# EAGLE design ledtiny85 (EAGLE 8.1.0)
DESIGNER: Willie Zhu
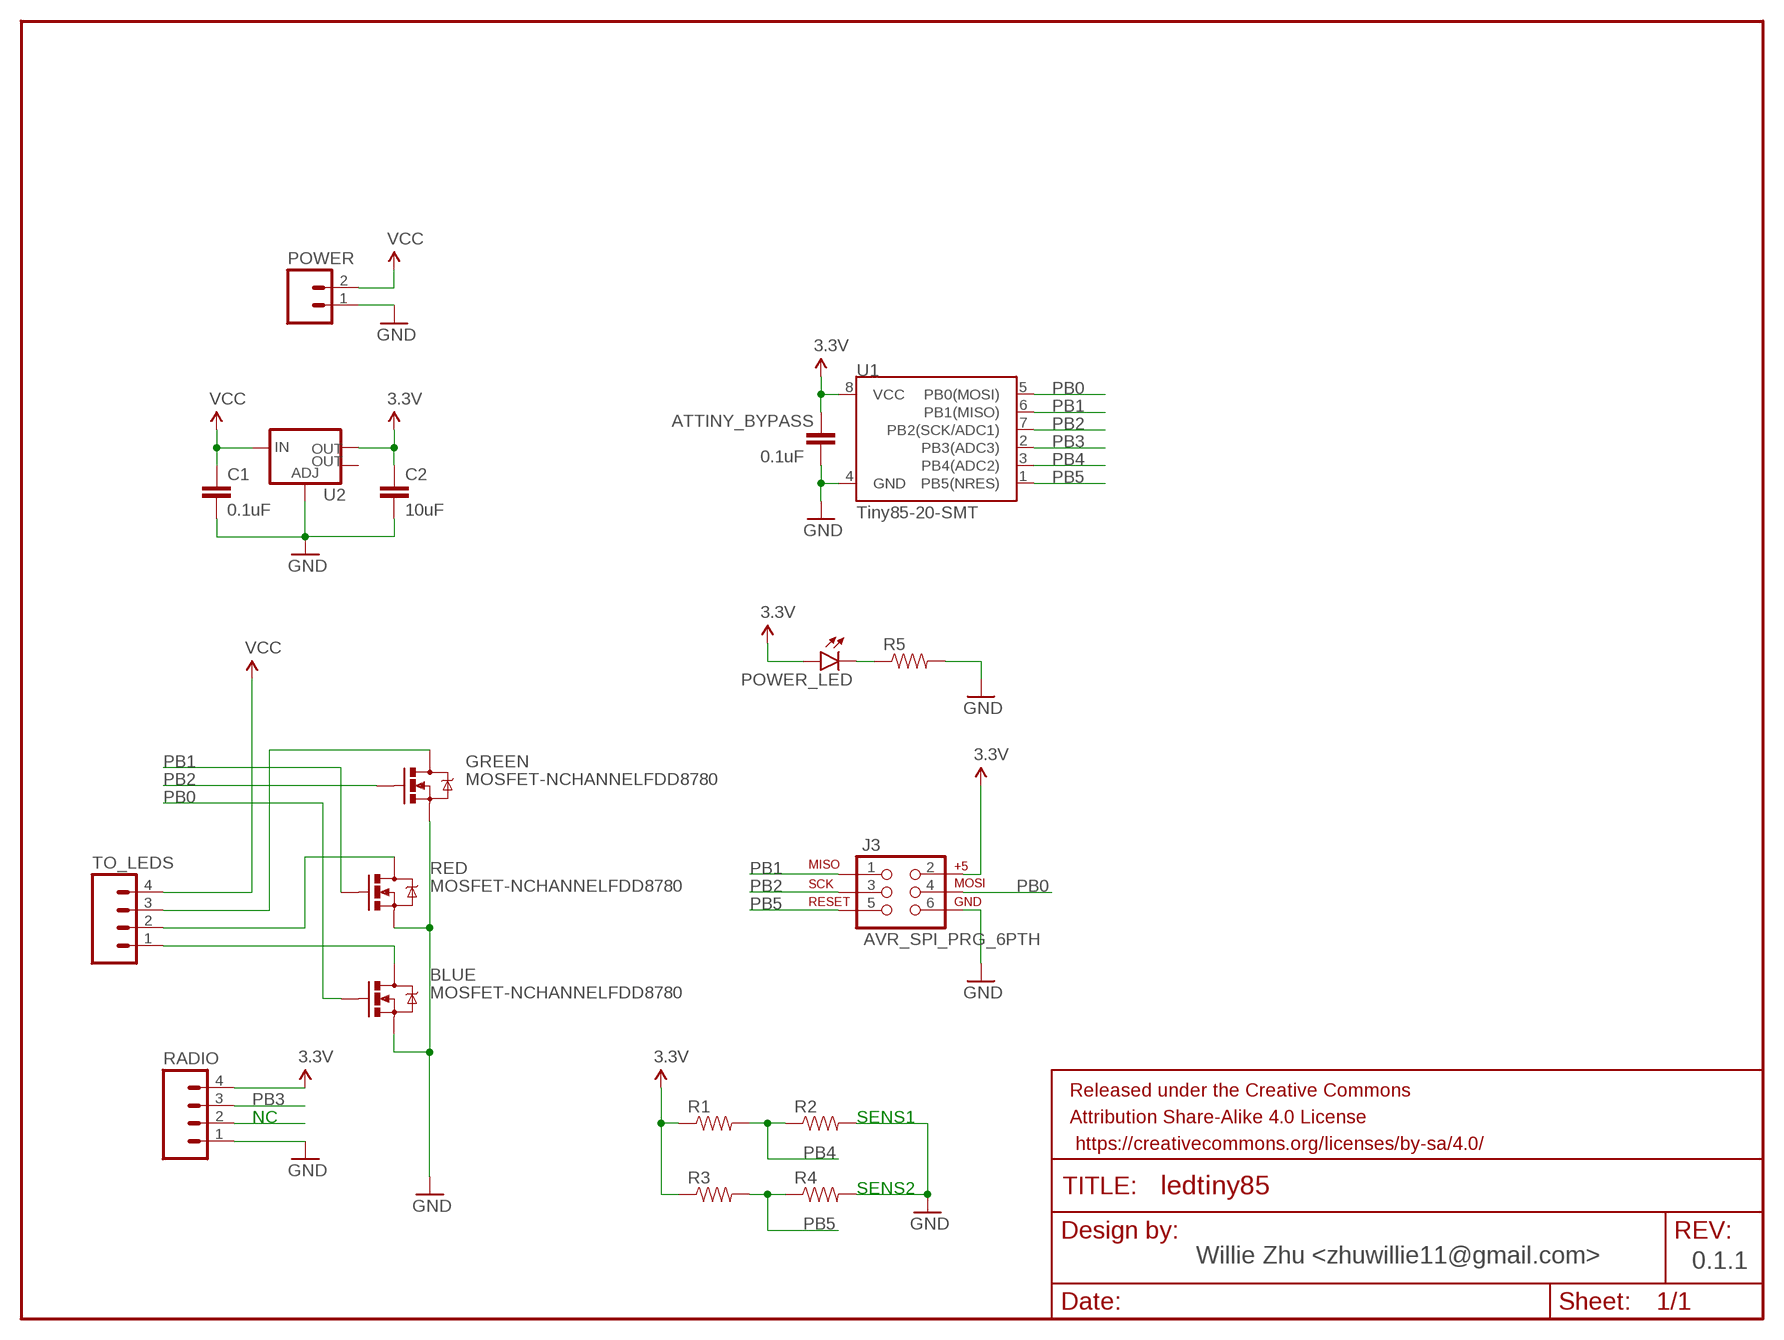
[diagram p0: schematic, sheet 1]

## Parts
ATTINY_BYPASS  0.1uF  CAP1206  [1206]
BLUE  MOSFET-NCHANNELFDD8780  [DPAK]
C1  0.1uF  CAP1206  [1206]
C2  10uF  CAP1206  [1206]
FRAME1  FRAME-LETTER  [CREATIVE_COMMONS]
GREEN  MOSFET-NCHANNELFDD8780  [DPAK]
J3  AVR_SPI_PRG_6PTH  [2X3]
POWER  M02PTH3  [1X02_LONGPADS]
POWER_LED  LED1206  [LED-1206]
R1  RESISTOR1206  [1206]
R2  RESISTOR1206  [1206]
R3  RESISTOR1206  [1206]
R4  RESISTOR1206  [1206]
R5  RESISTOR1206  [1206]
RADIO  M04LONGPADS  [1X04_LONGPADS]
RED  MOSFET-NCHANNELFDD8780  [DPAK]
TO_LEDS  M04LONGPADS  [1X04_LONGPADS]
U1  Tiny85-20-SMT  ATTINY45TINY85-20-SMT  [SO08-EIAJ]
U2  V_REG_LM1117SOT223  [SOT223]

## Nets
3.3V: ATTINY_BYPASS.1 C2.1 J3.2 POWER_LED.A R1.1 R3.1 RADIO.4 U1.8(VCC) U2.2(OUT)
BLUE: BLUE.4(D) TO_LEDS.1
GND: ATTINY_BYPASS.2 BLUE.3(S) C1.2 C2.2 GREEN.3(S) J3.6 POWER.1 R2.2 R4.2 R5.2 RADIO.1 RED.3(S) U1.4(GND) U2.1(ADJ)
GREEN: RED.4(D) TO_LEDS.2
N$1: POWER_LED.C R5.1
N$6: RADIO.2
PB0: BLUE.1(G) J3.4 U1.5(PB0(MOSI))
PB1: J3.1 RED.1(G) U1.6(PB1(MISO))
PB2: GREEN.1(G) J3.3 U1.7(PB2(SCK/ADC1))
PB3: RADIO.3 U1.2(PB3(ADC3))
PB4: R1.2 R2.1 U1.3(PB4(ADC2))
PB5: J3.5 R3.2 R4.1 U1.1(PB5(NRES))
RED: GREEN.4(D) TO_LEDS.3
VCC: C1.1 POWER.2 TO_LEDS.4 U2.3(IN)
Unconnected: U2.4(OUT)

## Notes on the sheet
- NC | SENS1
- SENS2
- Willie Zhu <zhuwillie11@gmail.com> | 0.1.1

## Library data of the parts
ATTINY_BYPASS C1 C2 = SparkFun-Passives:CAP: Capacitor Standard 0603 ceramic capacitor, and 0.1" leaded capacitor.
BLUE GREEN RED = SparkFun-DiscreteSemi:MOSFET-NCHANNEL: Common NMOSFET Parts MFG P/N Store ID Prod ID FDD8780 TRANS-09984 SI7820DN TRANS-11055 FDS6630A IC-08089 2N7002PW TRANS-11151 FQP30N06L COM-10213 TRANS-10060 BSS123LT1G TRANS-08345 BSS138 TRANS-00830 BS170 2N7000; PROD_ID: TRANS-09984
FRAME1 = SparkFun-Aesthetics:FRAME-LETTER: Schematic Frame Standard 8.5x11 US Letter frame
J3 = SparkFun-Connectors:AVR_SPI_PRG_6: AVR ISP 6 Pin This is the reduced ISP connector for AVR programming. Common on Arduino. This footprint will take up less PCB space and can be used with a 10-pin to 6-pin adapter such as SKU: BOB-08508 **Special note about "TEST_POINT" package. The stop mask is on the top side, so if you want your programming test points to be on the bottom of your board, make sure to place this package on the bottom side of the board. This also ensure that the orientation to program from the bottom side will be correct.
POWER = SparkFun-Connectors:M02: Standard 2-pin 0.1" header. Use with - straight break away headers ( PRT-00116) - right angle break away headers (PRT-00553) - swiss pins (PRT-00743) - machine pins (PRT-00117) - female headers (PRT-00115) Molex polarized connector foot print use with: PRT-08233 with associated crimp pins and housings. 2.54_SCREWTERM for use with PRT-10571. 3.5mm Screw Terminal footprints for PRT-08084 5mm Screw Terminal footprints for use with PRT-08432
POWER_LED = SparkFun-LED:LED: LEDs Standard schematic elements and footprints for 5mm, 3mm, 1206, and 0603 sized LEDs. 5mm - Spark Fun Electronics SKU : COM-00529 (and others)
R1-R5 = SparkFun-Passives:RESISTOR: Resistor Basic schematic elements and footprints for 0603, 1206, and PTH resistors.
RADIO TO_LEDS = SparkFun-Connectors:M04: Header 4 Standard 4-pin 0.1" header. Use with straight break away headers (SKU : PRT-00116), right angle break away headers (PRT-00553), swiss pins (PRT-00743), machine pins (PRT-00117), and female headers (PRT-00115). Molex polarized connector foot print use with SKU : PRT-08231 with associated crimp pins and housings. 1MM SMD Version SKU: PRT-10208; PROD_ID: CONN-09696
U1 = SparkFun-DigitalIC:ATTINY45: Atmel 8-pin 2/4/8kB flash uC; PROD_ID: IC-09092
U2 = SparkFun-PowerIC:V_REG_LM1117: Voltage Regulator LM1117 Standard adjustable voltage regulator but in SMD form. Spark Fun Electronics SKU : COM-00595; PROD_ID: VREG-08170

## Board
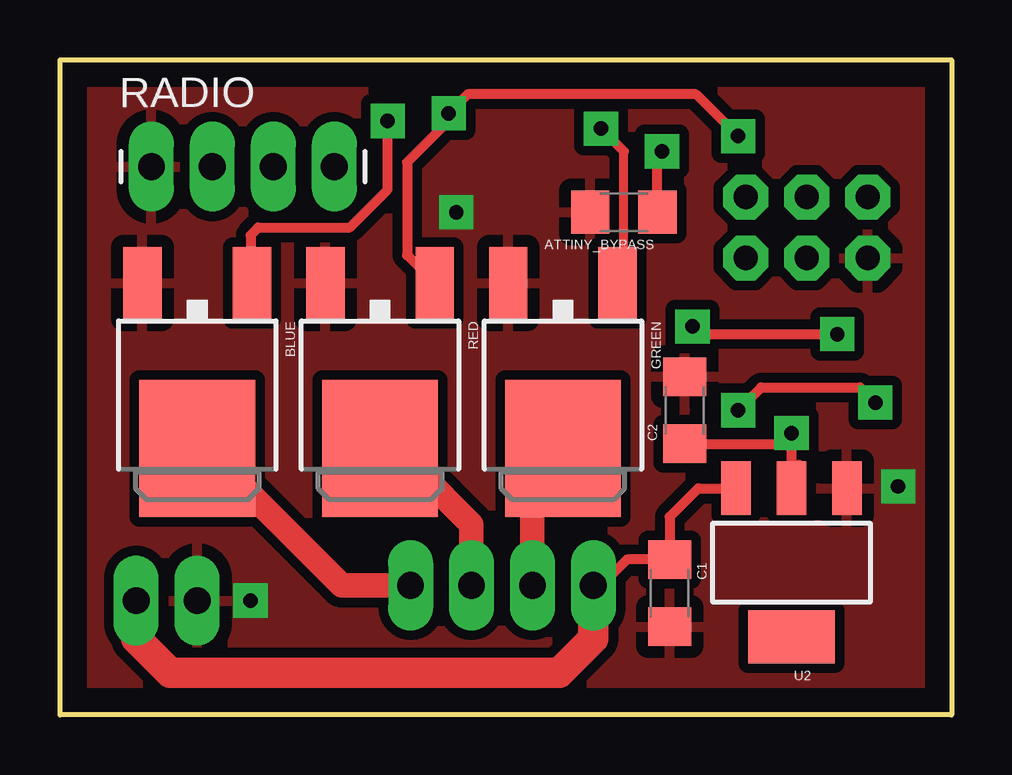
[diagram p1: board, top side]
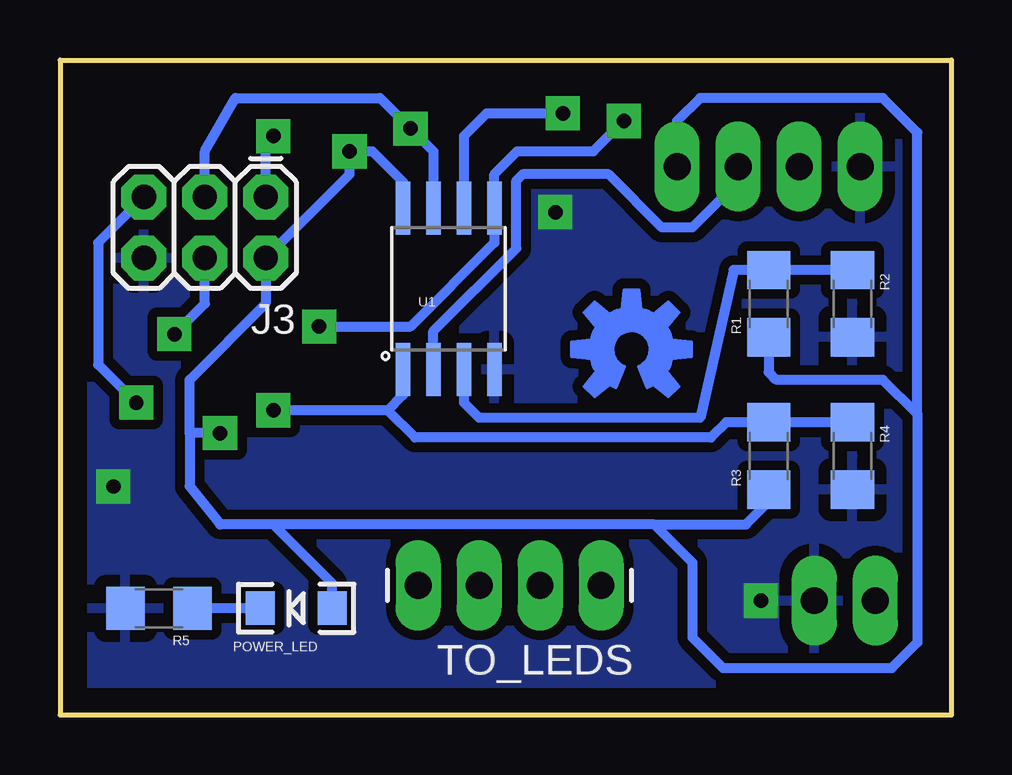
[diagram p2: board, bottom side, seen from below]

Size 37.15 x 27.3 mm. Coordinates in mm from the lower left corner, seen from the top.
Outline: 37.15,0 0,0 0,27.3 37.15,27.3 37.15,0
Copper layers (1*16): Top 0.035mm / dielectric 1.5mm / Bottom 0.035mm
Design rules "default *": minimum track width 10mil, minimum drill 16mil, track to track 16mil, track to pad 16mil, pad to pad 16mil, via to via 16mil, smd to smd 8mil, copper to edge 40mil, drill to drill 8mil, minimum pad ring 10mil, minimum via ring 8mil, stop-mask expansion 4mil, vias tented up to drill 0mil, thermal gap 20mil

### Footprints (pad centres in the part's own frame; a part is rotated, then mirrored left to right if it is on the bottom)
1206 = smd 1.6 x 1.8: 1 -1.4,0; 2 1.4,0
DPAK = smd 1.6 x 3: 1 -2.28,-5.31; 3 2.28,-5.31 | smd 4.826 x 5.715: 4 0,1.588
2X3 = drill 1.016 pad 1.88 octagon: 1 0,0; 2 0,2.54; 3 2.54,0; 4 2.54,2.54; 5 5.08,0; 6 5.08,2.54
1X02_LONGPADS = drill 1.118 pad 1.88 long: 1 0,0; 2 2.54,0
LED-1206 = smd 1.2 x 1.4: A -1.5,0; C 1.5,0
1X04_LONGPADS = drill 1.118 pad 1.88 long: 1 0,0; 2 2.54,0; 3 5.08,0; 4 7.62,0
SO08-EIAJ = smd 0.61 x 2.21: 1 -1.905,-3.378; 2 -0.635,-3.378; 3 0.635,-3.378; 4 1.905,-3.378; 5 1.905,3.353; 6 0.635,3.353; 7 -0.635,3.353; 8 -1.905,3.353
SOT223 = smd 1.219 x 2.235: 1 -2.311,-3.099; 2 0,-3.099; 3 2.311,-3.099 | smd 3.6 x 2.2: 4 0,3.099

### Placement (x,y rotation side)
ATTINY_BYPASS  23.5,20.96 180 top
BLUE  5.71,12.7 180 top
C1  25.4,5.08 270 top
C2  26.04,12.7 90 top
FRAME1  14.92,-13.02 0 top  (outside the outline)
GREEN  20.96,12.7 180 top
J3  28.57,21.59 180 bottom
POWER  5.71,4.76 0 bottom
POWER_LED  27.3,4.45 180 bottom
R1  7.62,17.14 90 bottom
R2  4.13,17.14 270 bottom
R3  7.62,10.79 90 bottom
R4  4.13,10.79 270 bottom
R5  33.02,4.45 180 bottom
RADIO  3.81,22.86 0 top
RED  13.33,12.7 180 top
TO_LEDS  14.6,5.4 180 bottom
U1  20.96,17.78 0 bottom
U2  30.48,6.35 180 top
U$2  [OSHW-LOGO-M_COPPER]  13.33,15.24 0 bottom

### Tracks (layer width: path | path; a pad name or v marks a point on that pad's centre or on a via)
3.3V  (via drill 0.6 pad 1.42)
  Top 0.406: 24.76,21.08 ATTINY_BYPASS.1 24.89,23.31 v25.08,23.49 | 30.8,10.43 30.8,9.77 U2.2 v30.48,11.75 30.35,11.3 C2.1
  Bottom 0.406: 31.75,11.75 31.75,9.52 30.48,7.94 28.26,7.94 | 31.75,11.75 31.75,13.97 28.57,17.14 J3.2 25.08,22.54 v25.08,23.49 24.13,23.49 22.86,22.23 U1.8 | 1.42,12.53 1.42,24.28 2.86,25.72 10.48,25.72 11.43,24.76 RADIO.4 | 1.42,12.53 1.42,3.02 2.49,1.96 9.52,1.96 10.8,3.23 10.8,6.35 12.38,7.94 | 7.62,15.24 R1.1 7.62,14.29 7.3,13.97 2.86,13.97 1.42,12.53 | 12.38,7.94 28.26,7.94 | 12.38,7.94 8.57,7.94 7.62,8.89 R3.1 | POWER_LED.A 25.8,5.49 28.26,7.94 | v30.48,11.75 31.75,11.75
BLUE
  Top 1.016: BLUE.4 6.03,11.11 11.75,5.4 TO_LEDS.1
GND  (via drill 0.6 pad 1.42)
  other vias: 34.92,9.52 7.94,4.76 16.51,20.96
  pour Top (isolate 0.406): 41.27,40.64 41.27,-1.27 -0.64,-1.27 -0.64,40.64
  pour Bottom (isolate 0.406): -1.9,41.91 42.54,41.91 42.54,-2.54 -1.9,-2.54
GREEN
  Top 1.016: 17.14,5.71 TO_LEDS.2 17.14,7.94 14.92,10.16 14.29,10.16 RED.4
N$1
  Bottom 0.406: POWER_LED.C R5.1
PB0  (via drill 0.6 pad 1.42)
  Top 0.406: BLUE.1 7.94,18.07 7.94,20 8.25,20.32 12.07,20.32 13.65,21.91 v13.65,24.76 | v26.35,16.19 26.67,15.87 v32.39,15.87
  Bottom 0.406: v32.39,15.87 31.12,17.14 J3.4 | v13.65,24.76 14.92,23.49 18.1,23.49 19.05,22.54 U1.5 19.05,19.69 22.54,16.19 v26.35,16.19
PB1  (via drill 0.6 pad 1.42)
  Top 0.406: RED.1 14.47,19.16 14.47,23.04 16.19,24.76 v16.19,25.08 16.99,25.88 26.51,25.88 v28.26,24.13
  Bottom 0.406: U1.6 20.32,24.13 19.37,25.08 v16.19,25.08 | J3.1 28.57,23.81 v28.26,24.13
PB2  (via drill 0.6 pad 1.42)
  Top 0.381: 23.49,18.27 23.49,23.49
  Top 0.406: GREEN.1 23.49,18.27 | 23.49,23.49 v22.54,24.45
  Bottom 0.406: U1.7 21.59,23.49 v22.54,24.45 23.81,25.72 29.85,25.72 31.12,23.49 J3.3
PB3
  Bottom 0.406: RADIO.3 8.89,22.23 10.8,20.32 12.07,20.32 14.29,22.54 17.88,22.54 18.14,22.28 18.14,19.45 21.59,16 U1.2
PB4
  Bottom 0.406: 20.32,14.6 U1.3 20.32,13.02 19.69,12.38 10.48,12.38 9.08,18.55 R1.2 R2.1
PB5  (via drill 0.6 pad 1.42)
  Top 0.406: v28.26,12.7 29.21,13.65 33.34,13.65 v33.97,13.02
  Bottom 0.406: J3.5 35.56,19.69 35.56,14.6 v33.97,13.02 | 23.49,12.7 v28.26,12.7 | 23.49,12.7 22.86,13.33 U1.1 | R4.1 R3.2 9.4,12.19 10.03,11.56 22.35,11.56 23.49,12.7
RED
  Top 1.016: TO_LEDS.3 19.69,9.84 GREEN.4
VCC
  Top 0.406: TO_LEDS.4 22.23,5.08 23.62,6.48 C1.1 25.4,8.25 26.59,9.45 U2.3
  Top 1.27: TO_LEDS.4 22.23,3.18 20.8,1.75 4.6,1.75 3.18,3.18 POWER.2

### Text on the board
tDocu: Willie Zhu